# Altium schematic sheet 1V8BUCK.SchDoc
size A
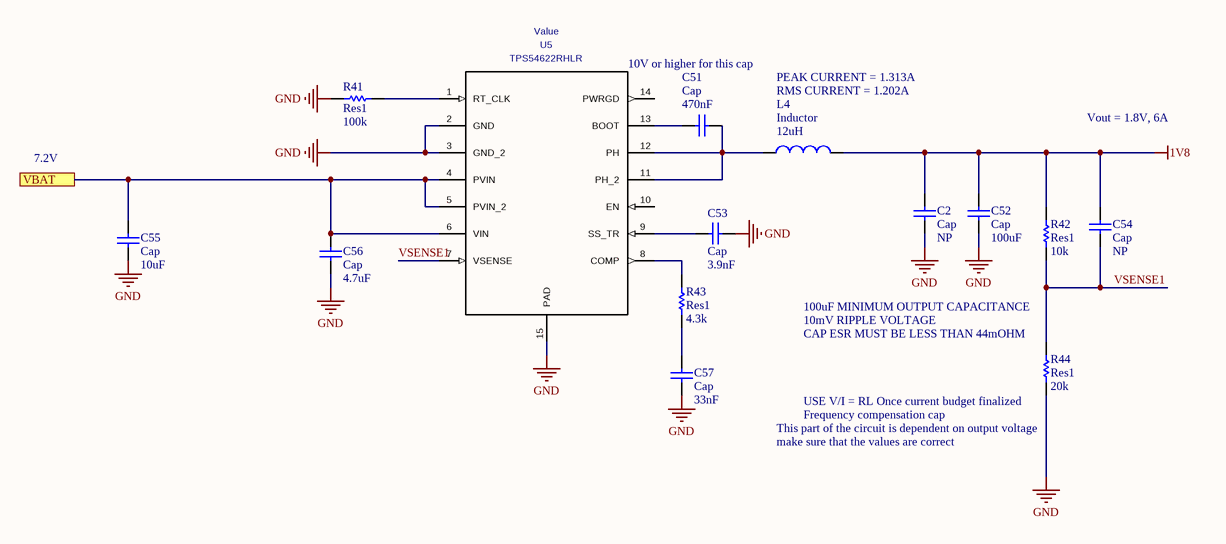
[diagram p0: 1V8BUCK.SchDoc]

## Parts
C2  Cap  value NP  [1608[0603]]
C51  Cap  value 470nF  [0402-A]
C52  Cap  value 100uF  [C1210]
C53  Cap  value 3.9nF  [0402-A]
C54  Cap  value NP  [1608[0603]]
C55  Cap  value 10uF  [6-0805_M]
C56  Cap  value 4.7uF  [6-0805_M]
C57  Cap  value 33nF  [0402-A]
L4  Inductor  value 12uH  [IND_BOURNS_SRR1260]
R41  Res1  value 100k  [0402-A]
R42  Res1  value 10k  [0402-A]
R43  Res1  value 4.3k  [0402-A]
R44  Res1  value 20k  [0402-A]
U5  TPS54622RHLR  [RHL0014A]

## Ports
VBAT

## Nets
1V8: C2.2 C52.2 C54.2 L4.2 R42.1
GND: C2.1 C52.1 C53.1 C55.1 C56.1 C57.1 R41.1 R44.1 U5.2(GND) U5.3(GND_2) U5.15(PAD)
VBAT: C55.2 C56.2 U5.4(PVIN) U5.5(PVIN_2) U5.6(VIN) ; port VBAT
VSENSE1: C54.1 R42.2 R44.2 U5.7(VSENSE)
NetC51_1: C51.1 U5.13(BOOT)
NetC51_2: C51.2 L4.1 U5.11(PH_2) U5.12(PH)
NetC53_2: C53.2 U5.9(SS_TR)
NetC57_2: C57.2 R43.1
NetR41_2: R41.2 U5.1(RT_CLK)
NetR43_2: R43.2 U5.8(COMP)

Not connected (* = marked no-connect by the designer): U5 10(EN) 14(PWRGD)

## Notes on the sheet
- (near U5) 10V or higher for this cap
- PEAK CURRENT = 1.313A
- RMS CURRENT = 1.202A
- Vout = 1.8V, 6A
- 7.2V
- 100uF MINIMUM OUTPUT CAPACITANCE
- 10mV RIPPLE VOLTAGE
- (near R44) CAP ESR MUST BE LESS THAN 44mOHM
- (near R44) USE V/I = RL Once current budget finalized
- Frequency compensation cap
- (near R44) This part of the circuit is dependent on output voltage
- make sure that the values are correct

## Library data of the parts
C2 C51-C57 = Cap: Capacitor; Published: 8-Jun-2000; LatestRevisionDate: 17-Jul-2002; LatestRevisionNote: Re-released for DXP Platform.; PackageReference: RAD-0.3; Publisher: Altium Limited; PackageDescription: Radial Cap, Thru-Hole; 2 Leads; 0.3 in Pin Spacing
L4 = Inductor: Code_IEC: 1005; Published: 8-Jun-2000; LatestRevisionDate: 29-May-2009; LatestRevisionNote: IPC-7351 Footprint Added.; PackageReference: 0402-A; Publisher: Altium Limited; PackageDescription: Chip Inductor; Code_JEITA: 0402
R41-R44 = Res1: Resistor; Published: 8-Jun-2000; LatestRevisionDate: 17-Jul-2002; LatestRevisionNote: Re-released for DXP Platform.; PackageReference: AXIAL-0.3; Publisher: Altium Limited; PackageDescription: Axial Device, Thru-Hole; 2 Leads; 0.3 in Pin Spacing
U5 = TPS54622RHLR: Manufacturer: Texas Instruments; CompType: IC; PIN_COUNT: 15; PartNumber: TPS54622RHLR; PackageReference: RHL0014A; MountType: SMT; RoHS: Y; Value: Value